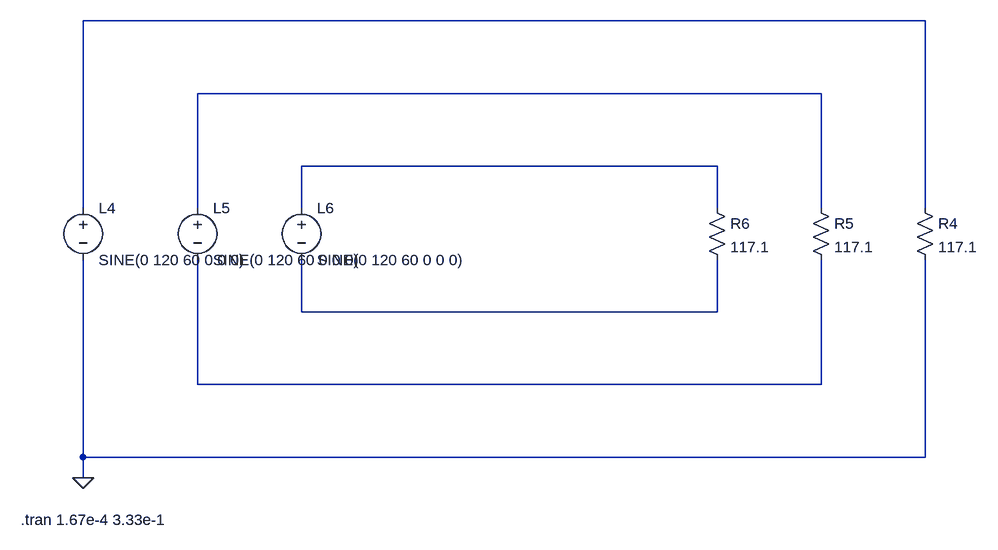
[diagram p0: schematic 3_Phasen_6_Leitersystem.asc]
3_Phasen_6_Leitersystem.asc, the LTspice schematic file:
Version 4
SHEET 1 880 680
WIRE 160 720 160 736
WIRE 336 720 336 736
WIRE 496 720 496 736
WIRE 1456 720 1456 736
WIRE 1296 720 1296 736
WIRE 1136 720 1136 736
WIRE 496 640 496 576
WIRE 496 576 1136 576
WIRE 1136 576 1136 640
WIRE 1136 736 1136 800
WIRE 1136 800 496 800
WIRE 496 800 496 736
WIRE 1296 640 1296 464
WIRE 1296 464 336 464
WIRE 336 464 336 640
WIRE 336 736 336 912
WIRE 336 912 1296 912
WIRE 1296 912 1296 736
WIRE 1456 640 1456 352
WIRE 1456 352 160 352
WIRE 160 352 160 640
WIRE 160 736 160 1024
WIRE 160 1024 1456 1024
WIRE 1456 1024 1456 736
WIRE 160 1056 160 1024
FLAG 160 1056 0
SYMBOL voltage 160 624 R0
SYMATTR InstName L4
SYMATTR Value SINE(0 120 60 0 0 0)
SYMBOL voltage 336 624 R0
SYMATTR InstName L5
SYMATTR Value SINE(0 120 60 0 0 0)
SYMBOL voltage 496 624 R0
SYMATTR InstName L6
SYMATTR Value SINE(0 120 60 0 0 0)
SYMBOL res 1440 624 R0
SYMATTR InstName R4
SYMATTR Value 117.1
SYMBOL res 1280 624 R0
SYMATTR InstName R5
SYMATTR Value 117.1
SYMBOL res 1120 624 R0
SYMATTR InstName R6
SYMATTR Value 117.1
TEXT 64 1120 Left 2 !.tran 1.67e-4 3.33e-1

The netlist it stands for:
* 3_Phasen_6_Leitersystem.asc
V§L4 N005 0 SINE(0 120 60 0 0 0)
V§L5 N004 N001 SINE(0 120 60 0 0 0)
V§L6 N003 N002 SINE(0 120 60 0 0 0)
R4 N005 0 117.1
R5 N004 N001 117.1
R6 N003 N002 117.1
.tran 1.67e-4 3.33e-1
.backanno
.end